# Altium schematic sheet schematic.SchDoc
size A3
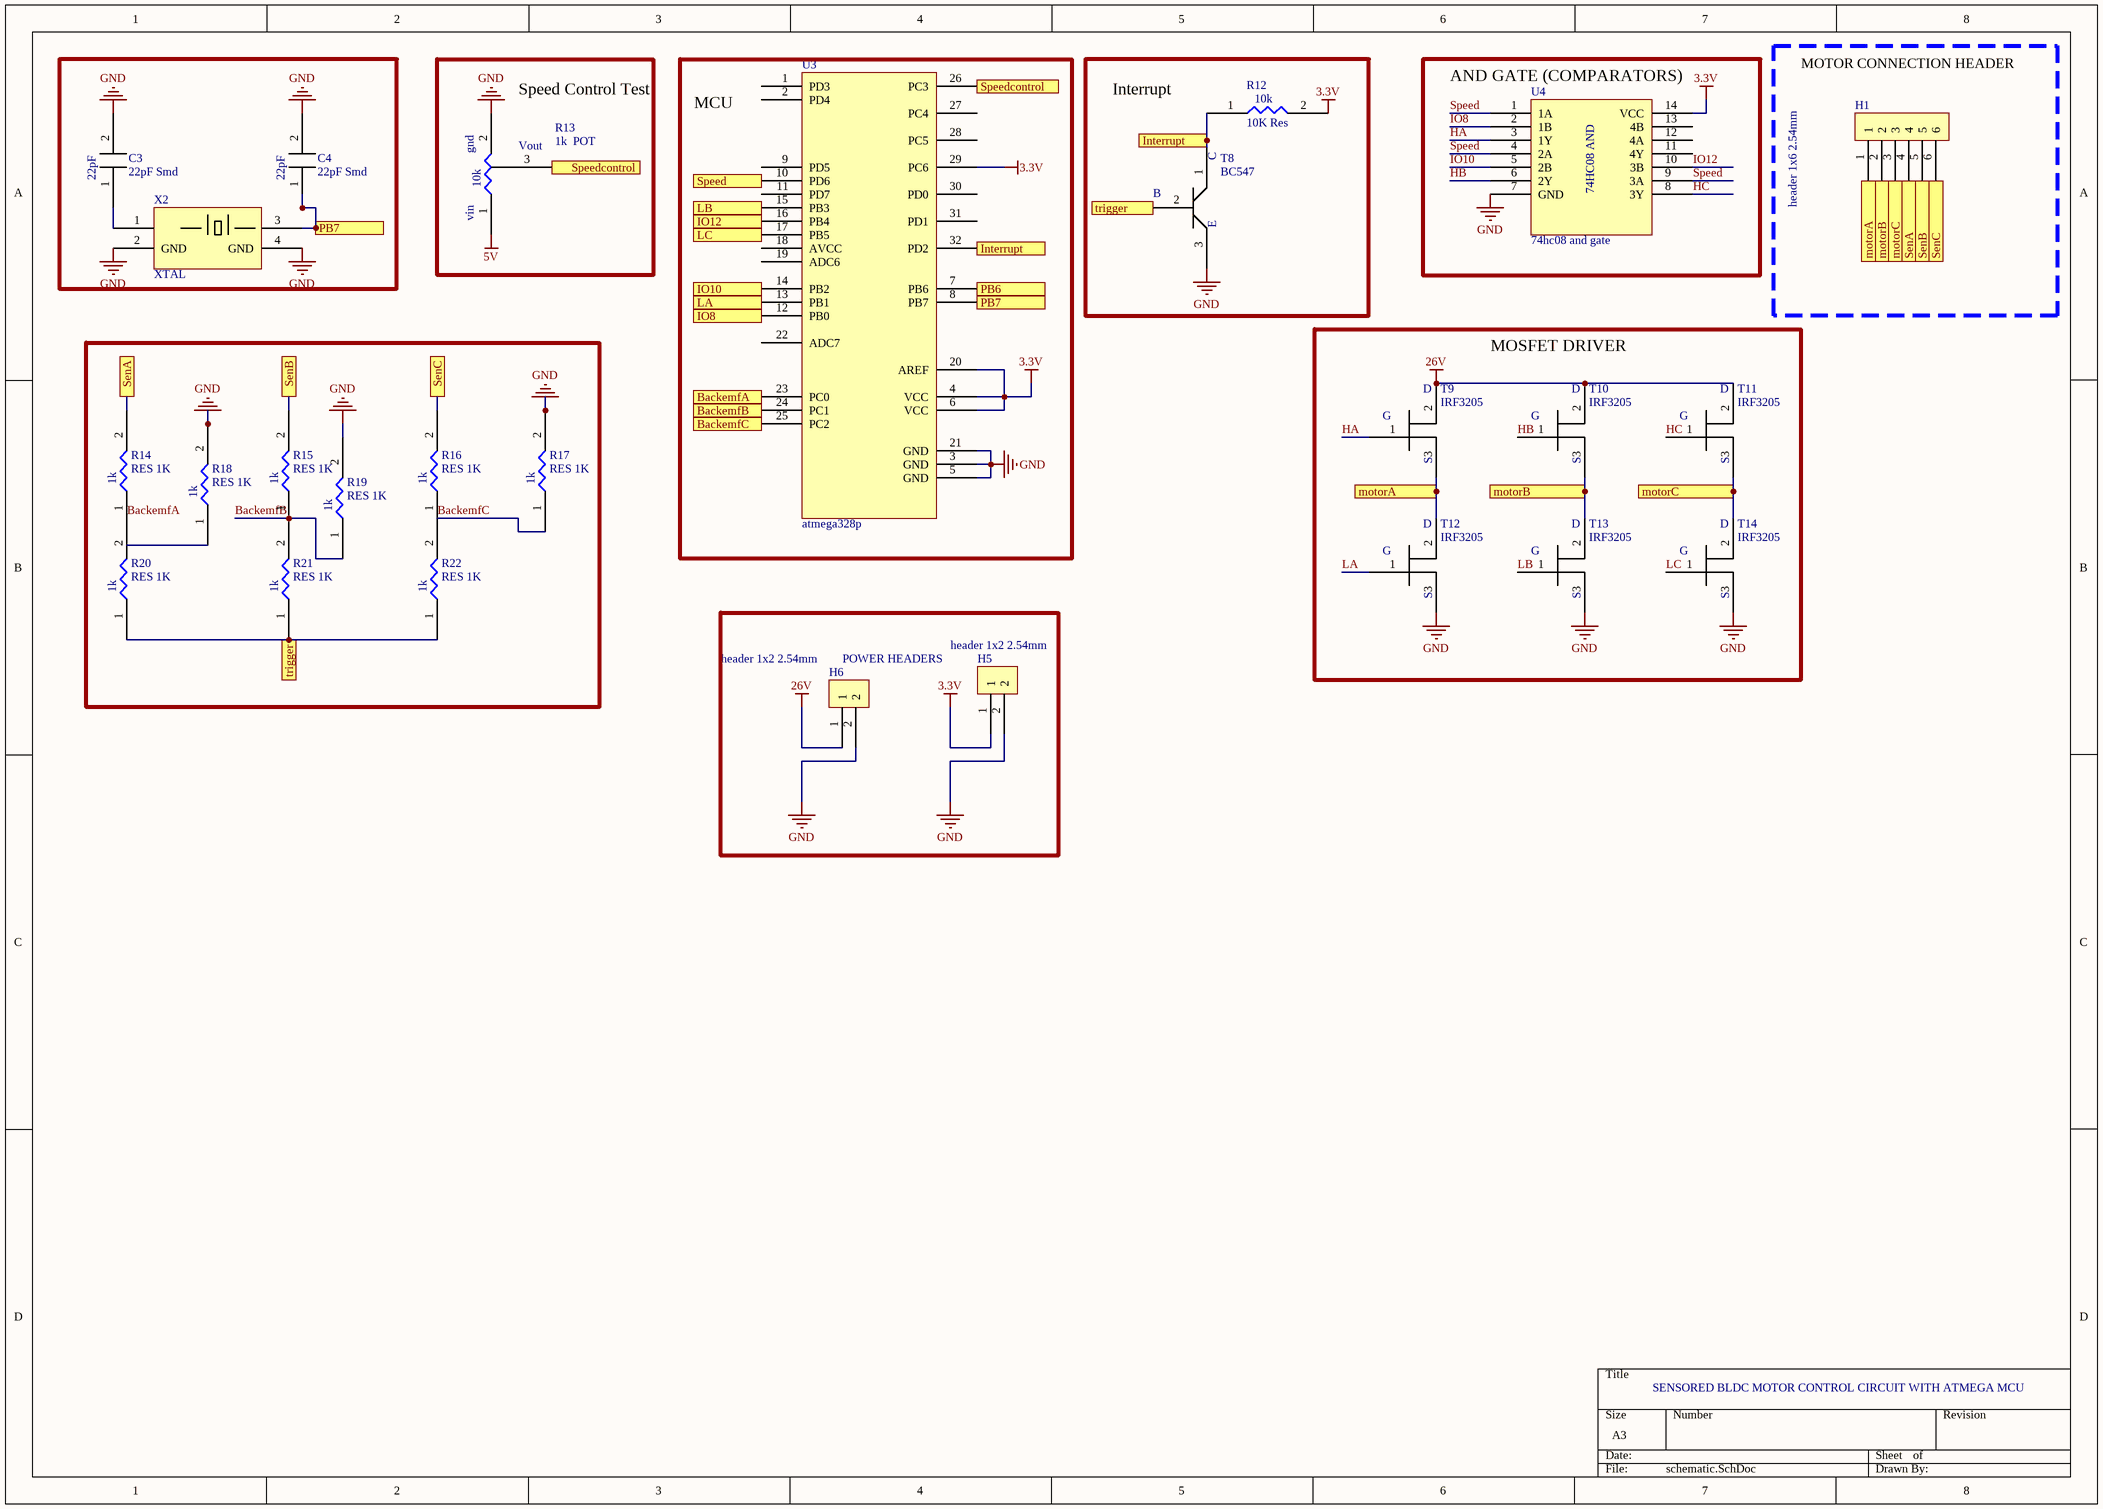
[diagram p0: schematic.SchDoc]

## Parts
C3  22pF Smd  [smd cap]
C4  22pF Smd  [smd cap]
H1  header 1x6 2.54mm  [Header 1x6 2.54mm]
H5  header 1x2 2.54mm  [HEADER 1X2 2.54mm]
H6  header 1x2 2.54mm  [HEADER 1X2 2.54mm]
R12  10K Res  [smd res]
R13  1k  POT  [smd trimpot]
R14  RES 1K  [smd res]
R15  RES 1K  [smd res]
R16  RES 1K  [smd res]
R17  RES 1K  [smd res]
R18  RES 1K  [smd res]
R19  RES 1K  [smd res]
R20  RES 1K  [smd res]
R21  RES 1K  [smd res]
R22  RES 1K  [smd res]
T8  BC547  [TO-92]
T9  IRF3205  [smd mosfet]
T10  IRF3205  [smd mosfet]
T11  IRF3205  [smd mosfet]
T12  IRF3205  [smd mosfet]
T13  IRF3205  [smd mosfet]
T14  IRF3205  [smd mosfet]
U3  atmega328p  [atmega238p]
U4  74hc08 and gate  [SOIC127P1030X265-14N]
X2  XTAL  [xtal]

## Ports
BackemfA (in), BackemfB (in), BackemfC (in), Interrupt, IO8, IO10, IO12, LA, LB, LC, motorA (in), motorA (out), motorB (in), motorB (out), motorC (in), motorC (out), PB6, PB7, SenA, SenA (in), SenB, SenB (in), SenC, SenC (in), Speed, Speedcontrol (in), Speedcontrol (out), trigger

## Nets
3.3V: H5.1 R12.2 U3.4(VCC) U3.6(VCC) U3.20(AREF) U3.29(PC6) U4.14(VCC)
5V: R13.1
26V: H6.1 T9.2 T10.2 T11.2
GND: C3.2 C4.2 H5.2 H6.2 R13.2(GND) R17.2 R18.2 R19.2 T8.3 T12.3 T13.3 T14.3 U3.3(GND) U3.5(GND) U3.21(GND) U4.7(GND) X2.2(GND) X2.4(GND)
BackemfA: U3.23(PC0) ; port BackemfA
BackemfA: R20.2  [a separate net that carries the same name]
BackemfB: U3.24(PC1) ; port BackemfB
BackemfB: R19.1 R21.2  [a separate net that carries the same name]
BackemfC: U3.25(PC2) ; port BackemfC
BackemfC: R17.1 R22.2  [a separate net that carries the same name]
HA: T9.1 U4.3(1Y)
HB: T10.1 U4.6(2Y)
HC: T11.1 U4.8(3Y)
Interrupt: R12.1 T8.1 U3.32(PD2) ; port Interrupt
IO8: U3.12(PB0) ; port IO8
IO8: U4.2(1B)  [a separate net that carries the same name]
IO10: U3.14(PB2) ; port IO10
IO10: U4.5(2B)  [a separate net that carries the same name]
IO12: U3.16(PB4) ; port IO12
IO12: U4.10(3B)  [a separate net that carries the same name]
LA: U3.13(PB1) ; port LA
LA: T12.1  [a separate net that carries the same name]
LB: U3.15(PB3) ; port LB
LB: T13.1  [a separate net that carries the same name]
LC: U3.17(PB5) ; port LC
LC: T14.1  [a separate net that carries the same name]
motorA: H1.1 T9.3 T12.2 ; port motorA
motorB: H1.2 T10.3 T13.2 ; port motorB
motorC: H1.3 T11.3 T14.2 ; port motorC
PB6: U3.7(PB6) ; port PB6
PB7: C4.1 U3.8(PB7) X2.3 ; port PB7
SenA: H1.4 R14.2 ; port SenA
SenB: H1.5 R15.2 ; port SenB
SenC: H1.6 R16.2 ; port SenC
Speed: U3.10(PD6) ; port Speed
Speed: U4.1(1A) U4.4(2A) U4.9(3A)  [a separate net that carries the same name]
Speedcontrol: R13.3 U3.26(PC3) ; port Speedcontrol
trigger: R20.1 R21.1 R22.1 T8.2 ; port trigger
NetC3_1: C3.1 X2.1

Not connected (* = marked no-connect by the designer): R14 1; R15 1; R16 1; R18 1; U3 1(PD3) 2(PD4) 9(PD5) 11(PD7) 18(AVCC) 19(ADC6) 22(ADC7) 27(PC4) 28(PC5) 30(PD0) 31(PD1); U4 11(4Y) 12(4A) 13(4B)

## Notes on the sheet
- Speed Control Test
- MCU
- Interrupt
- (near U4) AND GATE (COMPARATORS)
- MOTOR CONNECTION HEADER
- MOSFET DRIVER
- (near H6) POWER HEADERS
- SENSORED BLDC MOTOR CONTROL CIRCUIT WITH ATMEGA MCU
- (in symbol 1k  POT) gnd; Vout; 10k; vin
- (in symbol 10K Res) 10k
- (in symbol 22pF Smd) 22pF
- (in symbol 74hc08 and gate) 74HC08 AND
- (in symbol BC547) C; B; E
- (in symbol IRF3205) D; G; S
- (in symbol RES 1K) 1k

## Library data of the parts
R12 = 10K Res: 10K SMD Res
R14-R22 = RES 1K: 1K Res
X2 = XTAL: 16MHz Xtal